# Altium schematic sheet CC-S04-V00-SerialComs.SchDoc: Serial Communications (RS232 x2, RS485, Serial)
size A3; DrawnBy: Jonn Dillon; DocumentNumber: 5; SheetNumber: 5; SheetTotal: 13; Project: Chassis Controller (Interim) 2020
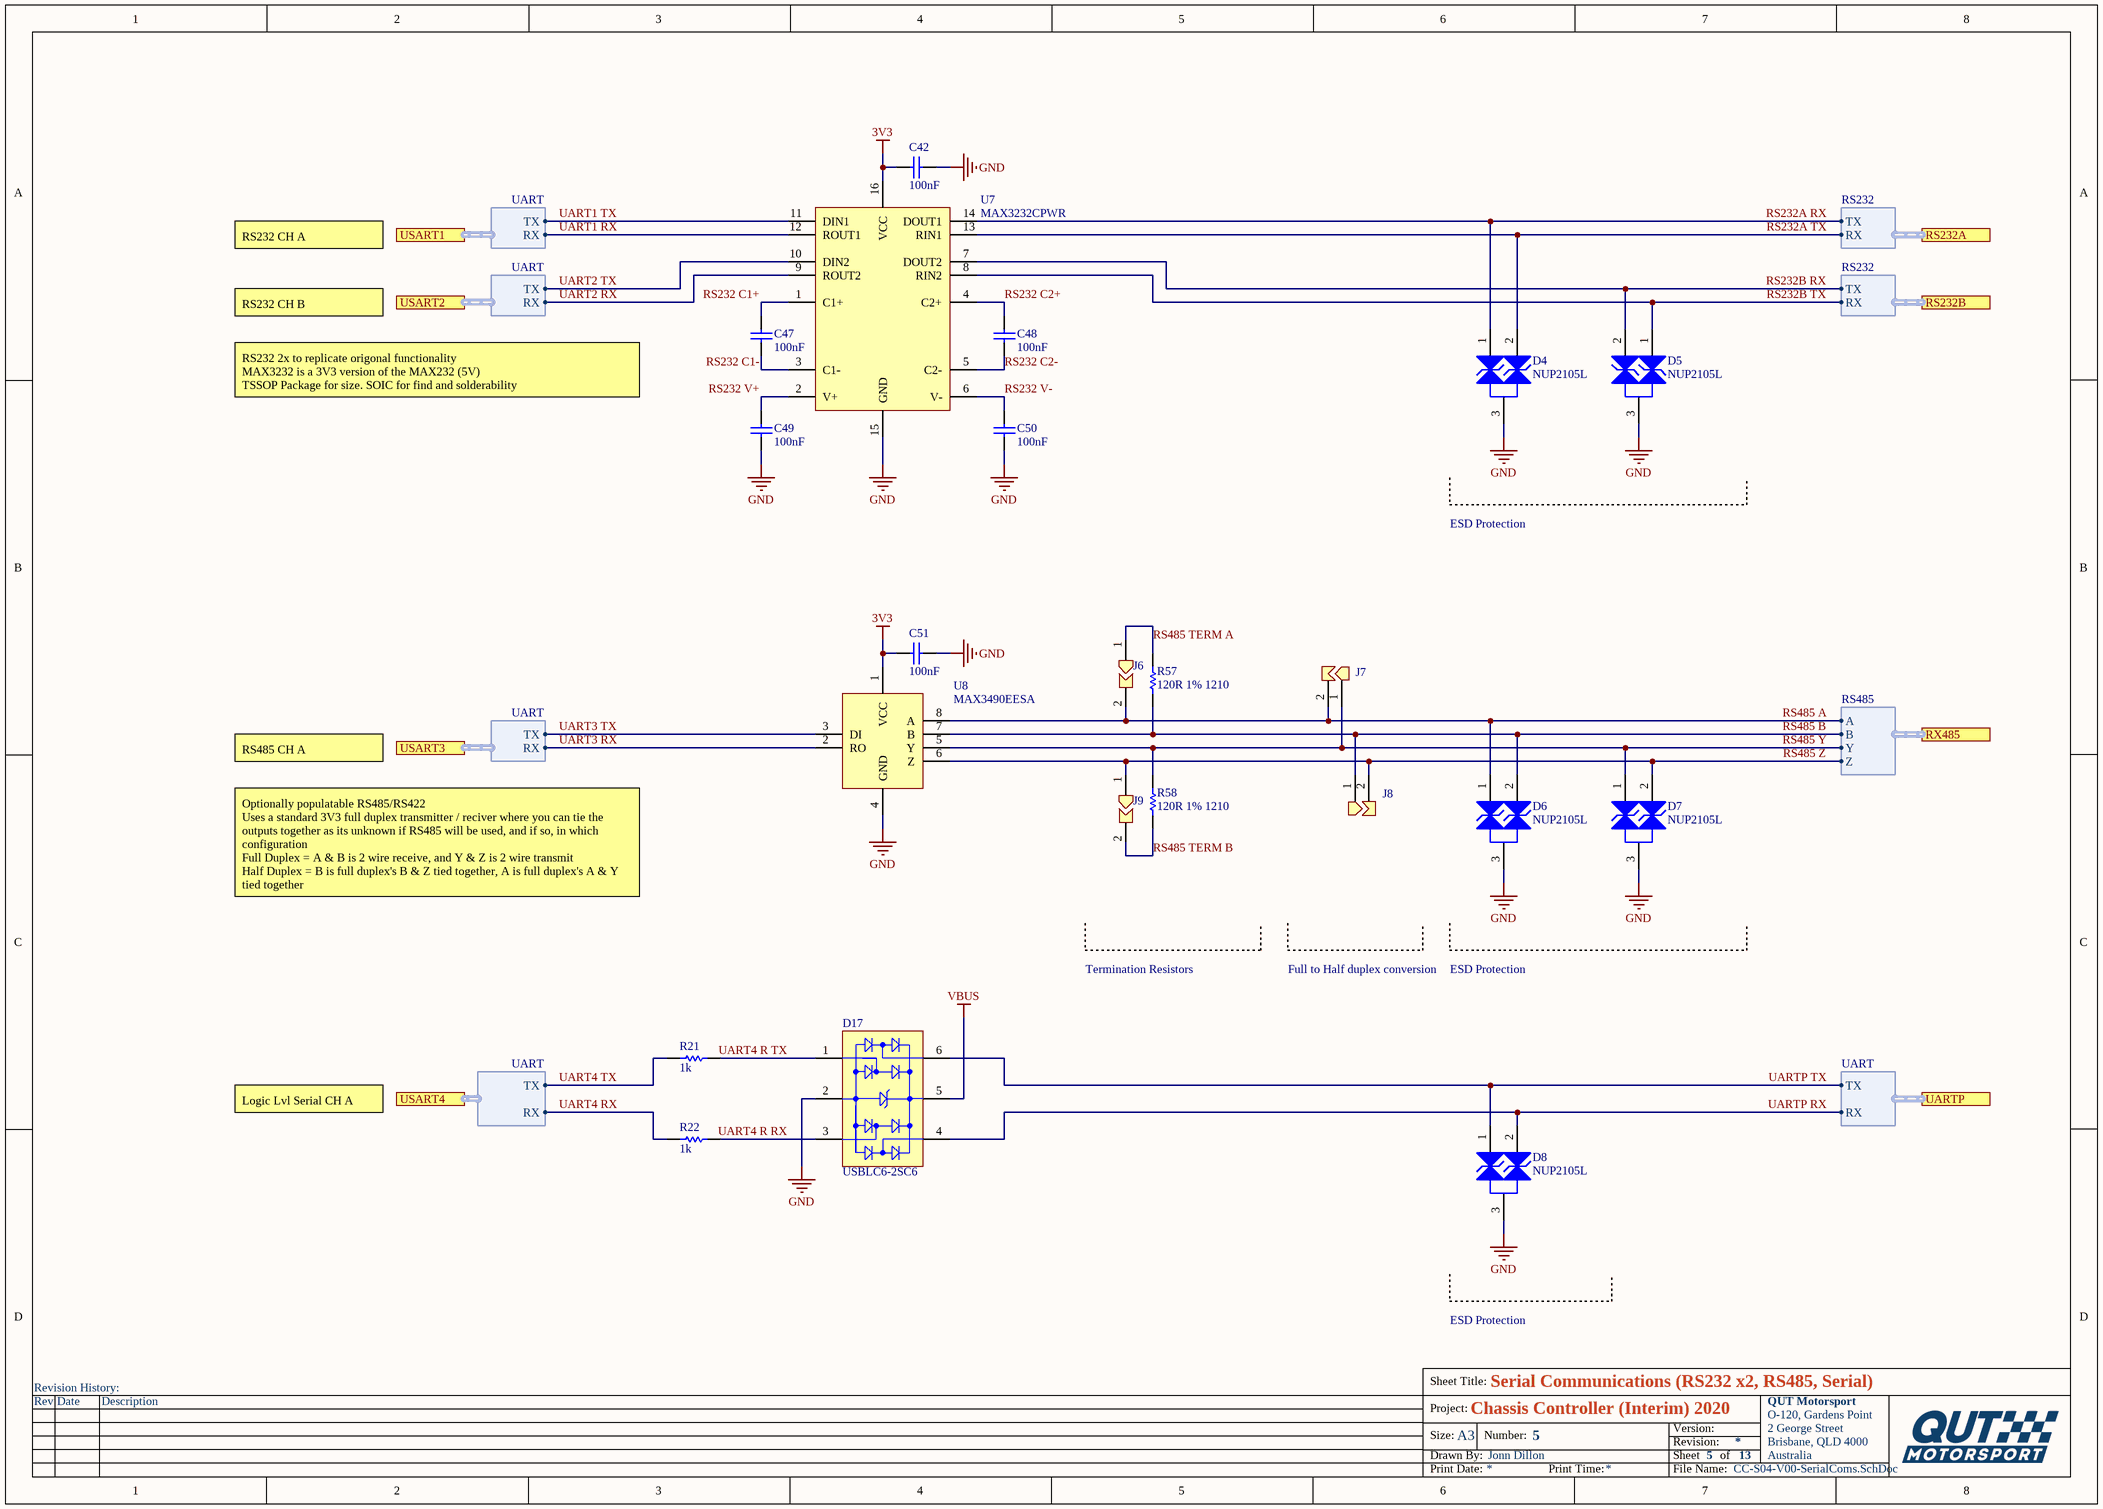
[diagram p0: CC-S04-V00-SerialComs.SchDoc]

## Parts
C42  100nF  [Cap_Ceramic_0603]
C47  100nF  [Cap_Ceramic_0603]
C48  100nF  [Cap_Ceramic_0603]
C49  100nF  [Cap_Ceramic_0603]
C50  100nF  [Cap_Ceramic_0603]
C51  100nF  [Cap_Ceramic_0603]
D4  NUP2105L  [NUP2105L]
D5  NUP2105L  [NUP2105L]
D6  NUP2105L  [NUP2105L]
D7  NUP2105L  [NUP2105L]
D8  NUP2105L  [NUP2105L]
D17  USBLC6-2SC6  [USBLC6-2SC6]
J6  Jumper 2Way Solderable  [Jumper_2Way_Solderable]  (value not drawn)
J7  Jumper 2Way Solderable  [Jumper_2Way_Solderable]  (value not drawn)
J8  Jumper 2Way Solderable  [Jumper_2Way_Solderable]  (value not drawn)
J9  Jumper 2Way Solderable  [Jumper_2Way_Solderable]  (value not drawn)
R21  1k  [Res_ThinFilm_0603]
R22  1k  [Res_ThinFilm_0603]
R57  120R 1% 1210  [Res_ThinFilm_1210]
R58  120R 1% 1210  [Res_ThinFilm_1210]
U7  MAX3232CPWR  [MAX3232CPWR]
U8  MAX3490EESA  [MAX3490EESA]

## Ports
RS232A (harness RS232), RS232B (harness RS232), RX485 (harness RS485), UARTP (harness UART), USART1 (harness UART), USART2 (harness UART), USART3 (harness UART), USART4 (harness UART)

## Harnesses
UART: TX, RX
RS232: TX, RX
RS485: A, B, Y, Z

## Nets
3V3: C42.1 C51.1 U7.16(VCC) U8.1(VCC)
GND: C42.2 C49.1 C50.1 C51.2 D4.3 D5.3 D6.3 D7.3 D8.3 D17.2(GND) U7.15(GND) U8.4(GND)
VBUS: D17.5(VBUS)
RS232 C1+: C47.2 U7.1(C1+)
RS232 C1-: C47.1 U7.3(C1-)
RS232 C2+: C48.2 U7.4(C2+)
RS232 C2-: C48.1 U7.5(C2-)
RS232 V+: C49.2 U7.2(V+)
RS232 V-: C50.2 U7.6(V-)
RS232A RX: D4.1 U7.14(DOUT1) ; port RS232A.TX
RS232A TX: D4.2 U7.13(RIN1) ; port RS232A.RX
RS232B RX: D5.2 U7.7(DOUT2) ; port RS232B.TX
RS232B TX: D5.1 U7.8(RIN2) ; port RS232B.RX
RS485 A: D6.1 J6.2 J7.2 U8.8(A) ; port RX485.A
RS485 B: D6.2 J8.1 R57.1 U8.7(B) ; port RX485.B
RS485 TERM A: J6.1 R57.2
RS485 TERM B: J9.2 R58.1
RS485 Y: D7.1 J7.1 R58.2 U8.5(Y) ; port RX485.Y
RS485 Z: D7.2 J8.2 J9.1 U8.6(Z) ; port RX485.Z
UART1 RX: U7.12(ROUT1) ; port USART1.RX
UART1 TX: U7.11(DIN1) ; port USART1.TX
UART2 RX: U7.9(ROUT2) ; port USART2.RX
UART2 TX: U7.10(DIN2) ; port USART2.TX
UART3 RX: U8.2(RO) ; port USART3.RX
UART3 TX: U8.3(DI) ; port USART3.TX
UART4 R RX: D17.3(I/O_2) R22.2
UART4 R TX: D17.1(I/O_1) R21.2
UART4 RX: R22.1 ; port USART4.RX
UART4 TX: R21.1 ; port USART4.TX
UARTP RX: D8.2 D17.4(I/O_3) ; port UARTP.RX
UARTP TX: D8.1 D17.6(I/O_4) ; port UARTP.TX

## Notes on the sheet
- RS232 CH A
- RS232 CH B
- RS232 2x to replicate origonal functionality
  MAX3232 is a 3V3 version of the MAX232 (5V)
  TSSOP Package for size. SOIC for find and solderability
- ESD Protection
- RS485 CH A
- Optionally populatable RS485/RS422
  Uses a standard 3V3 full duplex transmitter / reciver where you can tie the outputs together as its unknown if RS485 will be used, and if so, in which configuration
  Full Duplex = A & B is 2 wire receive, and Y & Z is 2 wire transmit
  Half Duplex = B is full duplex's B & Z tied together, A is full duplex's A & Y tied together
- Termination Resistors
- Full to Half duplex conversion
- Logic Lvl Serial CH A
- Revision History:
- Sheet Title:
- Rev
- Date
- Description
- Project:
- Size:
- Drawn By:
- A3
- Number:
- Revision:
- Sheet
- Version:
- of
- QUT Motorsport
- O-120, Gardens Point
- 2 George Street
- Brisbane, QLD 4000
- Australia
- Print Date:
- Print Time:
- File Name:

## Library data of the parts
C42 C47-C51 = 100nF 50V 5% X7R 0603: Capacitor, Ceramic, SMD, 100nF, 50V, 5%, X7R, 0603
D17 = USBLC6-2SC6: Very low capacitance ESD protection, 3.5 pF, -40 to 125 degC, 6-Pin SOT23, RoHS, Tape and Reel
J6 J9 = Jumper 2Way Vert Solderable
J7 J8 = Jumper 2Way Side Solderable
R21 R22 = 1k 5% 0603: Resistor, SMD, 1k, 0.1W, 5%, 0603
R57 R58 = 120R 1% 1210: Resistor, SMD, 120R, 0.25W, 1%, 1210
U7 = MAX3232CPWR: MAX3232CPWR - IC, LINE DRIVER, 3-5.5V, SMD
U8 = MAX3490EESA: IC, RS422/RS485 TRANSCEIVER, 3.6V, SOIC8
D4-D8 = NUP2105L: ComponentLink1Description: Datasheet; ComponentLink1URL: https://www.onsemi.cn/PowerSolutions/document/NUP2105L-D.PDF; ComponentLink2Description: LCSC; ComponentLink2URL: https://lcsc.com/product-detail/TVS_ON-Semiconductor-NUP2105LT1G_C14486.html; ComponentLink3Description: Digikey; ComponentLink3URL: https://www.digikey.com.au/product-detail/en/on-semiconductor/SZNUP2105LT1G/SZNUP2105LT1GOSCT-ND/3487669